# EAGLE design 1 (EAGLE 9.6.2)
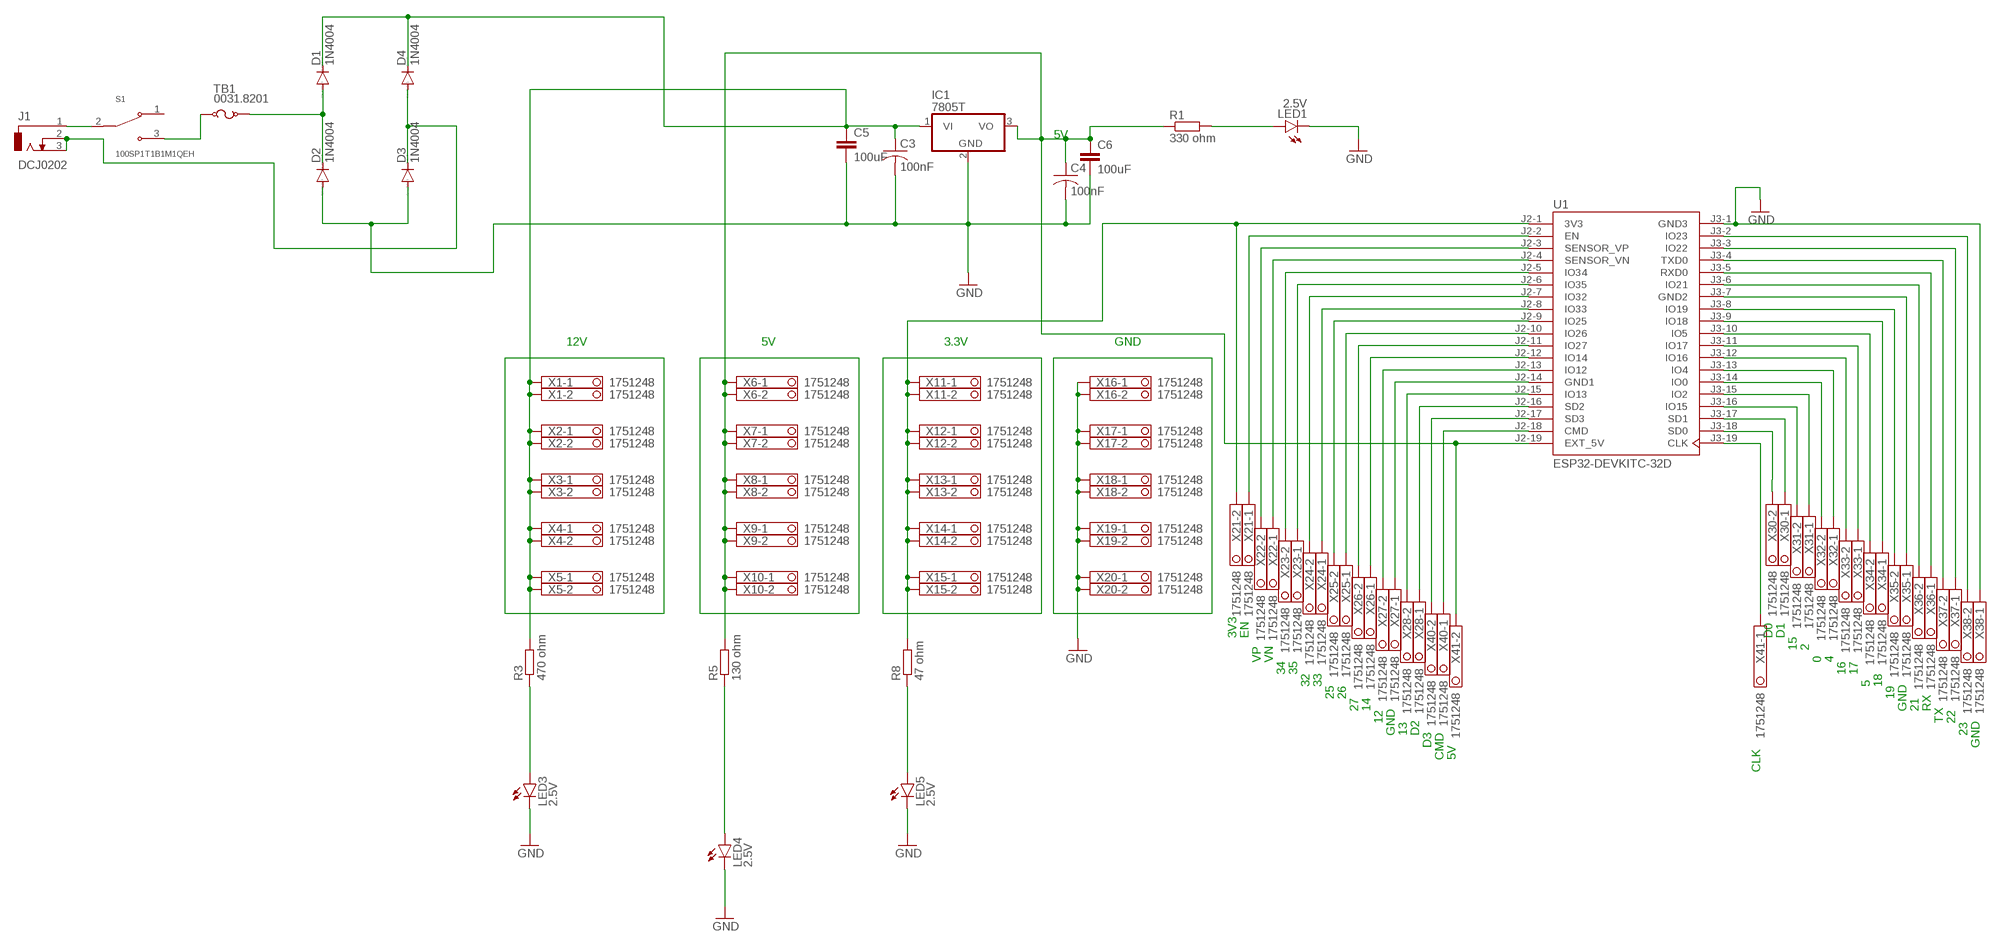
[diagram p0: schematic, sheet 1]

## Parts
C3  100nF  C-US025-024X044  [C025-024X044]
C4  100nF  C-US025-024X044  [C025-024X044]
C5  100uF  C-EU025-050X050  [C025-050X050]
C6  100uF  C-EU025-050X050  [C025-050X050]
D1  1N4004  [DO41-10]
D2  1N4004  [DO41-10]
D3  1N4004  [DO41-10]
D4  1N4004  [DO41-10]
IC1  7805T  [TO220H]
J1  DCJ0202  [DCJ0202]
LED1  2.5V  LED3MM  [LED3MM]
LED3  2.5V  LED3MM  [LED3MM]
LED4  2.5V  LED3MM  [LED3MM]
LED5  2.5V  LED3MM  [LED3MM]
R1  330 ohm  R-EU_0207/10  [0207/10]
R3  470 ohm  R-EU_0207/10  [0207/10]
R5  130 ohm  R-EU_0207/10  [0207/10]
R8  47 ohm  R-EU_0207/10  [0207/10]
S1  100SP1T1B1M1QEH  [SW_100SP1T1B1M1QEH]
TB1  0031.8201  [SCHURTER_0031.8201]
U1  ESP32-DEVKITC-32D  [MODULE_ESP32-DEVKITC-32D]
X1  1751248  [1751248]
X2  1751248  [1751248]
X3  1751248  [1751248]
X4  1751248  [1751248]
X5  1751248  [1751248]
X6  1751248  [1751248]
X7  1751248  [1751248]
X8  1751248  [1751248]
X9  1751248  [1751248]
X10  1751248  [1751248]
X11  1751248  [1751248]
X12  1751248  [1751248]
X13  1751248  [1751248]
X14  1751248  [1751248]
X15  1751248  [1751248]
X16  1751248  [1751248]
X17  1751248  [1751248]
X18  1751248  [1751248]
X19  1751248  [1751248]
X20  1751248  [1751248]
X21  1751248  [1751248]
X22  1751248  [1751248]
X23  1751248  [1751248]
X24  1751248  [1751248]
X25  1751248  [1751248]
X26  1751248  [1751248]
X27  1751248  [1751248]
X28  1751248  [1751248]
X30  1751248  [1751248]
X31  1751248  [1751248]
X32  1751248  [1751248]
X33  1751248  [1751248]
X34  1751248  [1751248]
X35  1751248  [1751248]
X36  1751248  [1751248]
X37  1751248  [1751248]
X38  1751248  [1751248]
X40  1751248  [1751248]
X41  1751248  [1751248]

## Nets
GND: C3.2 C4.2 C5.2 C6.2 D2.A D3.A IC1.2(GND) LED1.K(C) LED3.K(C) LED4.K(C) LED5.K(C) U1.J3-1(GND3) X16.1 X16.2 X17.1 X17.2 X18.1 X18.2 X19.1 X19.2 X20.1 X20.2 X38.1
N$5: D3.C D4.A J1.2 J1.3
N$6: C4.1 C6.1 IC1.3(VO) R1.1 R5.2 U1.J2-19(EXT_5V) X6.1 X6.2 X7.1 X7.2 X8.1 X8.2 X9.1 X9.2 X10.1 X10.2 X41.2
N$7: LED1.A R1.2
N$8: R8.2 U1.J2-1(3V3) X11.1 X11.2 X12.1 X12.2 X13.1 X13.2 X14.1 X14.2 X15.1 X15.2 X21.2
N$9: U1.J2-2(EN) X21.1
N$10: U1.J2-3(SENSOR_VP) X22.2
N$11: U1.J2-4(SENSOR_VN) X22.1
N$12: U1.J2-5(IO34) X23.2
N$13: U1.J2-6(IO35) X23.1
N$14: U1.J2-7(IO32) X24.2
N$15: U1.J2-8(IO33) X24.1
N$16: U1.J2-9(IO25) X25.2
N$17: U1.J2-10(IO26) X25.1
N$18: U1.J2-11(IO27) X26.2
N$19: U1.J2-12(IO14) X26.1
N$20: U1.J2-13(IO12) X27.2
N$21: U1.J2-14(GND1) X27.1
N$22: U1.J2-15(IO13) X28.2
N$23: U1.J2-16(SD2) X28.1
N$24: U1.J2-17(SD3) X40.2
N$25: U1.J2-18(CMD) X40.1
N$26: U1.J3-19(CLK) X41.1
N$27: U1.J3-18(SD0) X30.2
N$28: U1.J3-17(SD1) X30.1
N$29: U1.J3-16(IO15) X31.2
N$30: U1.J3-15(IO2) X31.1
N$31: U1.J3-14(IO0) X32.2
N$32: U1.J3-13(IO4) X32.1
N$33: U1.J3-12(IO16) X33.2
N$34: U1.J3-11(IO17) X33.1
N$35: U1.J3-10(IO5) X34.2
N$36: U1.J3-9(IO18) X34.1
N$37: U1.J3-8(IO19) X35.2
N$38: U1.J3-7(GND2) X35.1
N$39: U1.J3-6(IO21) X36.2
N$40: U1.J3-5(RXD0) X36.1
N$41: U1.J3-4(TXD0) X37.2
N$42: U1.J3-3(IO22) X37.1
N$43: U1.J3-2(IO23) X38.2
N$44: LED3.A R3.1
N$45: D1.A D2.C TB1.2
N$46: S1.3 TB1.1
N$47: C3.1 C5.1 D1.C D4.C IC1.1(VI) R3.2 X1.1 X1.2 X2.1 X2.2 X3.1 X3.2 X4.1 X4.2 X5.1 X5.2
N$50: J1.1 S1.2
N$53: LED4.A R5.1
N$54: LED5.A R8.1
Unconnected: S1.1

## Notes on the sheet
- 5V
- 12V | 5V | 3.3V | GND
- 3V3 | EN | D0 | D1
- 15 | 2
- VP | VN | 0 | 4
- 34 | 35 | 16 | 17
- 32 | 33 | 5 | 18
- 25 | 26 | 19
- 27 | 14 | GND | 21 | RX
- 12 | TX | 22
- GND | 13 | D2 | 23
- D3 | GND
- CMD | 5V
- CLK

## Library data of the parts
C3 C4 = rcl:C-US: CAPACITOR, American symbol; SPICEPREFIX: C
C5 C6 = rcl:C-EU: CAPACITOR, European symbol; SPICEPREFIX: C
D1-D4 = diode:1N4004: DIODE general purpose rectifier, 1 A
IC1 = linear:78*: Positive VOLTAGE REGULATOR Source: http://cache.national.com/ds/LM/LM78L05.pdf http://www.fairchildsemi.com/ds/LM/LM7805.pdf
J1 = con-jack:DCJ0202: DC POWER JACK Source: DCJ0202.pdf; OC_FARNELL: unknown; OC_NEWARK: unknown
LED1 LED3-LED5 = led:LED: LED OSRAM: - CHIPLED LG R971, LG N971, LY N971, LG Q971, LY Q971, LO R971, LY R971 LH N974, LH R974 LS Q976, LO Q976, LY Q976 LO Q996 - Hyper CHIPLED LW Q18S LB Q993, LB Q99A, LB R99A - SideLED LS A670, LO A670, LY A670, LG A670, LP A670 LB A673, LV A673, LT A673, LW A673 LH A674 LY A675 LS A676, LA A676, LO A676, LY A676, LW A676 LS A679, LY A679, LG A679 - Hyper Micro SIDELED® LS Y876, LA Y876, LO Y876, LY Y876 LT Y87S - SmartLED LW L88C, LW L88S LB L89C, LB L89S, LG L890 LS L89K, LO L89K, LY L89K LS L896, LA L896, LO L896, LY L896 - TOPLED LS T670, LO T670, LY T670, LG T670, LP T670 LSG T670, LSP T670, LSY T670, LOP T670, LYG T670 LG T671, LOG T671, LSG T671 LB T673, LV T673, LT T673, LW T673 LH T674 LS T676, LA T676, LO T676, LY T676, LB T676, LH T676, LSB T676, LW T676 LB T67C, LV T67C, LT T67C, LS T67K, LO T67K, LY T67K, LW E67C LS E67B, LA E67B, LO E67B, LY E67B, LB E67C, LV E67C, LT E67C LW T67C LS T679, LY T679, LG T679 LS T770, LO T770, LY T770, LG T770, LP T770 LB T773, LV T773, LT T773, LW T773 LH T774 LS E675, LA E675, LY E675, LS T675 LS T776, LA T776, LO T776, LY T776, LB T776 LHGB T686 LT T68C, LB T68C - Hyper Mini TOPLED® LB M676 - Mini TOPLED Santana® LG M470 LS M47K, LO M47K, LY M47K Source: http://www.osram.convergy.de LUXEON: - LUMILED® LXK2-PW12-R00, LXK2-PW12-S00, LXK2-PW14-U00, LXK2-PW14-V00 LXK2-PM12-R00, LXK2-PM12-S00, LXK2-PM14-U00 LXK2-PE12-Q00, LXK2-PE12-R00, LXK2-PE12-S00, LXK2-PE14-T00, LXK2-PE14-U00 LXK2-PB12-K00, LXK2-PB12-L00, LXK2-PB12-M00, LXK2-PB14-N00, LXK2-PB14-P00, LXK2-PB14-Q00 LXK2-PR12-L00, LXK2-PR12-M00, LXK2-PR14-Q00, LXK2-PR14-R00 LXK2-PD12-Q00, LXK2-PD12-R00, LXK2-PD12-S00 LXK2-PH12-R00, LXK2-PH12-S00 LXK2-PL12-P00, LXK2-PL12-Q00, LXK2-PL12-R00 Source: www.luxeon.com KINGBRIGHT: KA-3528ASYC Source: www.kingbright.com
R1 R3 R5 R8 = rcl:R-EU_: RESISTOR, European symbol; SPICEPREFIX: R
S1 = 100SP1T1B1M1QEH:100SP1T1B1M1QEH: Toggle Switch SPDT Panel Mount Check availability <https://pricing.snapeda.com/parts/100SP1T1B1M1QEH/E-Switch/view-part?ref=eda>; AVAILABILITY: In Stock; CHECK_PRICES: https://www.snapeda.com/parts/100SP1T1B1M1QEH/E-Switch/view-part/?ref=eda; DESCRIPTION: Toggle Switch, 100 Series, SPDT, ON-NONE-ON, Sealed, 5A, 120VAC, 28VDC, Solder | E-Switch 100SP1T1B1M1QEH; MF: E-Switch; MP: 100SP1T1B1M1QEH; PACKAGE: None; PRICE: None; PURCHASE-URL: https://www.snapeda.com/api/url_track_click_mouser/?unipart_id=423929&manufacturer=E-Switch&part_name=100SP1T1B1M1QEH&search_term=sw-t3-2b-a-a3-s1; SNAPEDA_LINK: https://www.snapeda.com/parts/100SP1T1B1M1QEH/E-Switch/view-part/?ref=snap
TB1 = 0031.8201:0031.8201: Fuse Block; 1-Pole; 500V; 10A; Solder THT; PCB Mnt, 22.5mm Pin Spacing; 5x20mm; UL94V-0 Check availability <https://pricing.snapeda.com/parts/0031.8201/Schurter%20Inc./view-part?ref=eda>; AVAILABILITY: In Stock; CHECK_PRICES: https://www.snapeda.com/parts/0031.8201/Schurter+Inc./view-part/?ref=eda; DESCRIPTION: Fuseholder, 250V, 10A, 22.5, 3 kV, @ 50 Hz, 1 Minute, Copper Alloy, OGN Series | Schurter 0031.8201; MF: Schurter Inc.; MP: 0031.8201; PACKAGE: None; PRICE: None; PURCHASE-URL: https://www.snapeda.com/api/url_track_click_mouser/?unipart_id=235177&manufacturer=Schurter Inc.&part_name=0031.8201&search_term=0031.8201; SNAPEDA_LINK: https://www.snapeda.com/parts/0031.8201/Schurter+Inc./view-part/?ref=snap
U1 = ESP32-DEVKITC-32D:ESP32-DEVKITC-32D: Check availability <https://pricing.snapeda.com/parts/ESP32-DEVKITC-32D/Espressif%20Systems/view-part?ref=eda>; AVAILABILITY: In Stock; CHECK_PRICES: https://www.snapeda.com/parts/ESP32-DEVKITC-32D/Espressif+Systems/view-part/?ref=eda; DESCRIPTION: WiFi Development Tools (802.11) ESP32 General Development Kit, ESP32-WROOM-32D on the board; MF: Espressif Systems; MP: ESP32-DEVKITC-32D; PACKAGE: None; PRICE: None; PURCHASE-URL: https://www.snapeda.com/api/url_track_click_mouser/?unipart_id=2777395&manufacturer=Espressif Systems&part_name=ESP32-DEVKITC-32D&search_term=None; SNAPEDA_LINK: https://www.snapeda.com/parts/ESP32-DEVKITC-32D/Espressif+Systems/view-part/?ref=snap
X1-X28 X30-X38 X40 X41 = con-phoenix-350:1751248: MKDS 1/ 2-3,5 Printklemme Nennstrom: 10 A Bemessungsspannung: 160 V Raster: 3,5 mm Polzahl: 2 Montageart: Löten Anschlussart: Schraubanschluss Anschlussrichtung vom Leiter zur Platine: 0° Source: http://eshop.phoenixcontact.com .. 1751248.pdf; OC_FARNELL: unknown; OC_NEWARK: unknown

## Board
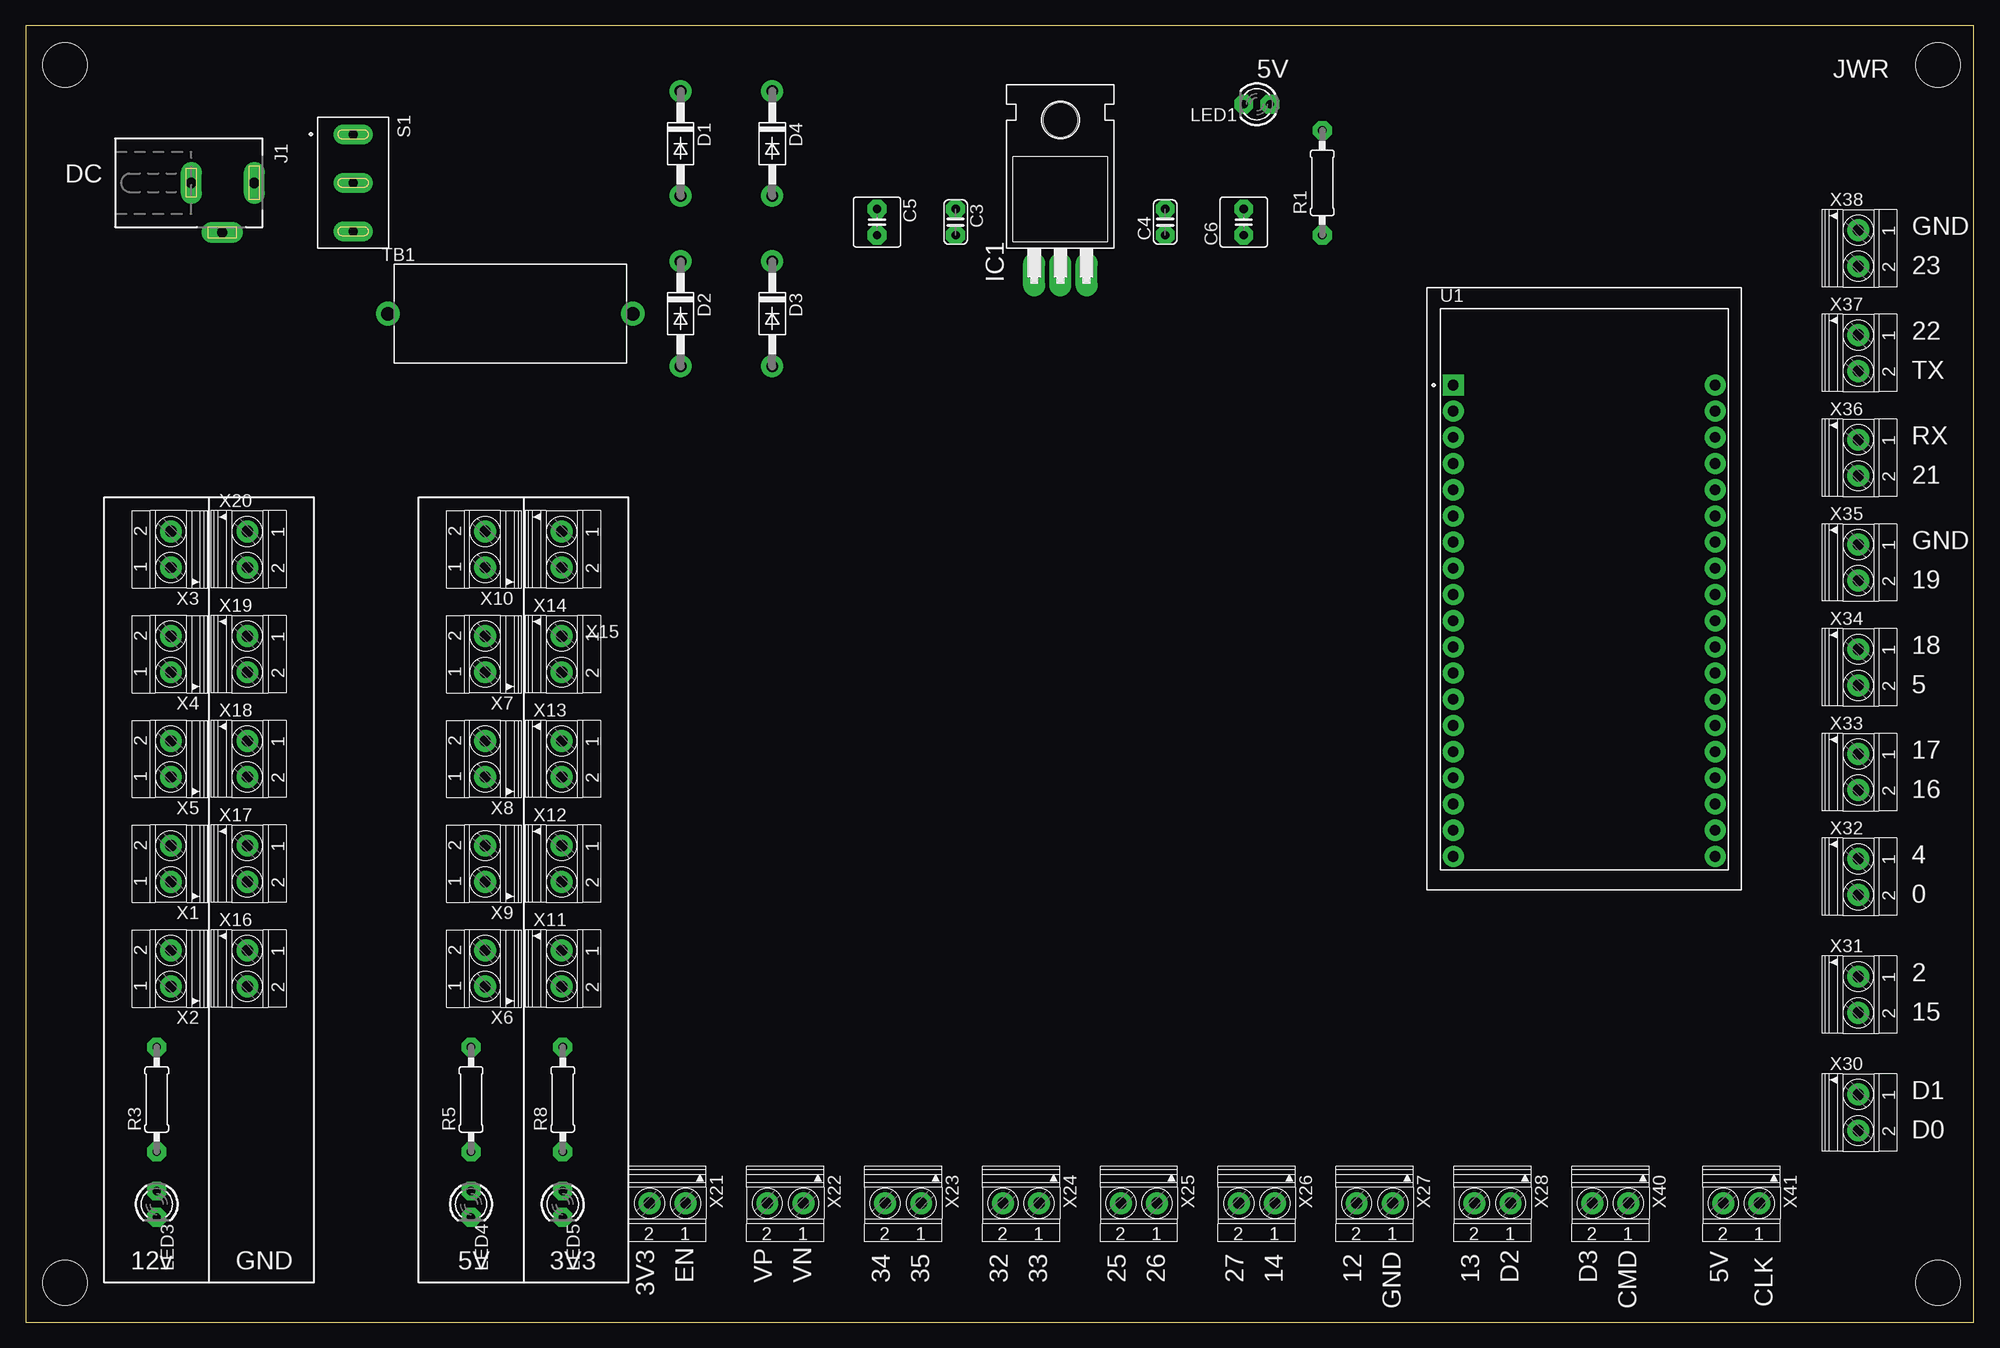
[diagram p1: board, top side]
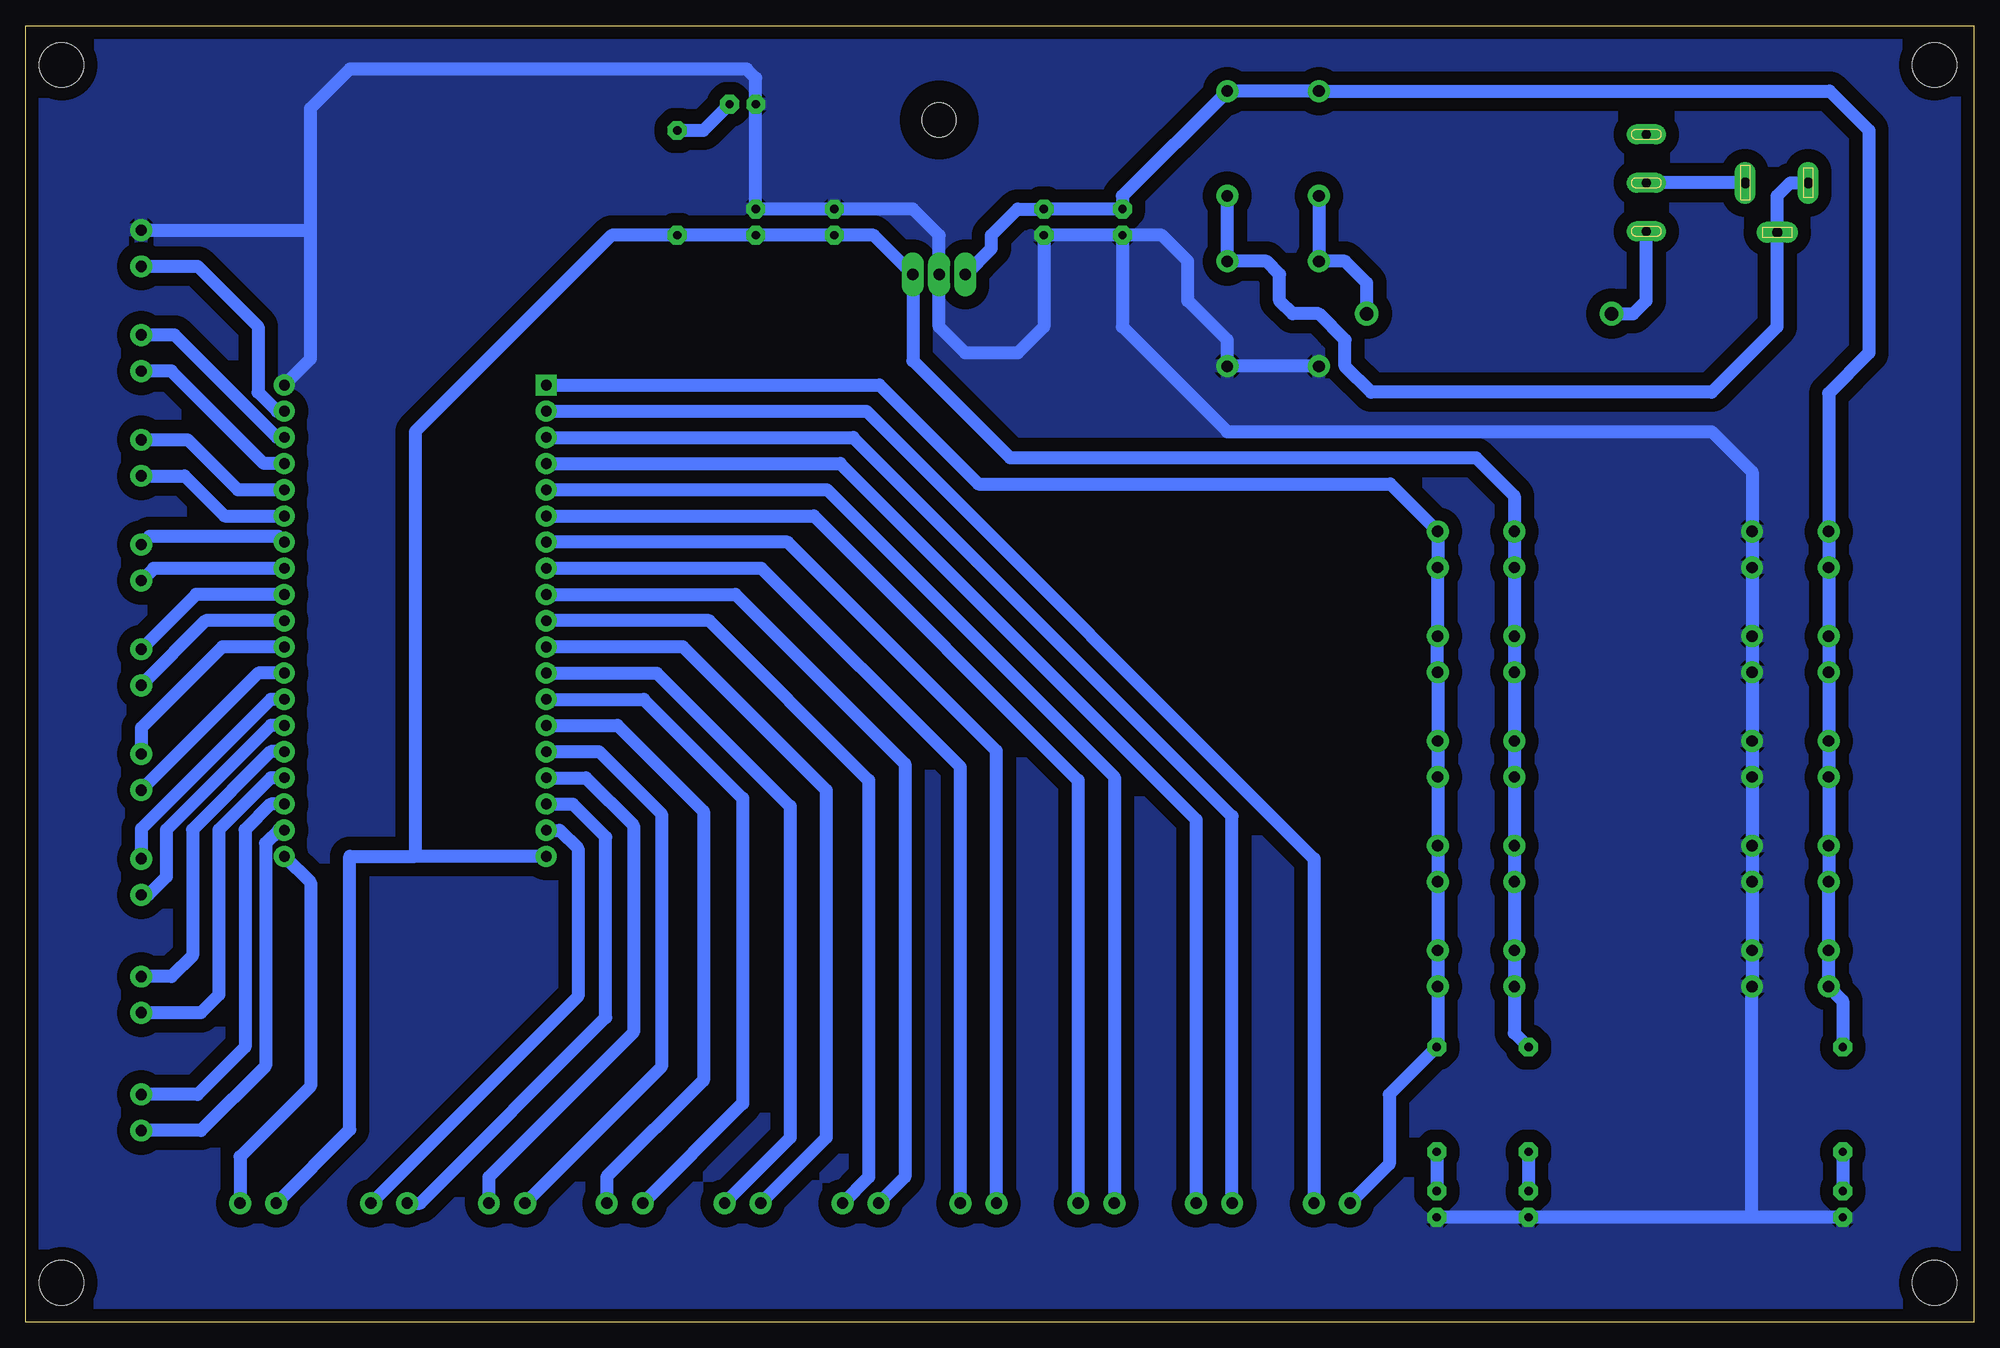
[diagram p2: board, bottom side, seen from below]

Size 188.9 x 125.72 mm. Coordinates in mm from the lower left corner, seen from the top.
Outline: 0,0 188.9,0 188.9,125.72 0,125.72 0,0
Copper layers (1*16): Top 0.035mm / dielectric 1.5mm / Bottom 0.035mm
Design rules "default *": minimum track width 50mil, minimum drill 0.35mm, track to track 6mil, track to pad 6mil, pad to pad 6mil, via to via 6mil, smd to smd 6mil, copper to edge 50mil, drill to drill 10mil, minimum pad ring 20mil, minimum via ring 8mil, stop-mask expansion 10mil, vias tented up to drill 0mil, thermal gap 10mil
Holes 4.32 mm at 3.81,121.92 3.81,3.81 185.42,3.81 185.42,121.92

### Footprints (pad centres in the part's own frame; a part is rotated, then mirrored left to right if it is on the bottom)
C025-024X044 = drill 0.813 octagon: 1 -1.27,0; 2 1.27,0
C025-050X050 = drill 0.813 octagon: 1 -1.27,0; 2 1.27,0
DO41-10 = drill 1.118: A 5.08,0; C -5.08,0
TO220H = drill 1.118 long: 1 -2.54,-10.16; 2 0,-10.16; 3 2.54,-10.16 | hole 3.302: 0,4.826
DCJ0202 = drill 1 pad 2 long: 1 0,3.1; 2 4.8,0; 3 0,-3
LED3MM = drill 0.813 octagon: A -1.27,0; K 1.27,0
0207/10 = drill 0.813 octagon: 1 -5.08,0; 2 5.08,0
SW_100SP1T1B1M1QEH = drill 0.91 pad 1.81 long: 1 -4.7,0; 2 0,0; 3 4.7,0
SCHURTER_0031.8201 = drill 1.3: 1 -11.875,0; 2 11.875,0
MODULE_ESP32-DEVKITC-32D = drill 1.04 square: J2-1 -12.7,19.76 | drill 1.04: J2-2 -12.7,17.22; J2-3 -12.7,14.68; J2-4 -12.7,12.14; J2-5 -12.7,9.6; J2-6 -12.7,7.06; J2-7 -12.7,4.52; J2-8 -12.7,1.98; J2-9 -12.7,-0.56; J2-10 -12.7,-3.1; J2-11 -12.7,-5.64; J2-12 -12.7,-8.18; J2-13 -12.7,-10.72; J2-14 -12.7,-13.26; J2-15 -12.7,-15.8; J2-16 -12.7,-18.34; J2-17 -12.7,-20.88; J2-18 -12.7,-23.42; J2-19 -12.7,-25.96; J3-1 12.7,19.76; J3-2 12.7,17.22; J3-3 12.7,14.68; J3-4 12.7,12.14; J3-5 12.7,9.6; J3-6 12.7,7.06; J3-7 12.7,4.52; J3-8 12.7,1.98; J3-9 12.7,-0.56; J3-10 12.7,-3.1; J3-11 12.7,-5.64; J3-12 12.7,-8.18; J3-13 12.7,-10.72; J3-14 12.7,-13.26; J3-15 12.7,-15.8; J3-16 12.7,-18.34; J3-17 12.7,-20.88; J3-18 12.7,-23.42; J3-19 12.7,-25.96
1751248 = drill 1.1 pad 1.7: 1 -1.75,-0.1; 2 1.75,-0.1

### Placement (x,y rotation side)
C3  90.17,106.68 270 top
C4  110.49,106.68 90 top
C5  82.55,106.68 270 top
C6  118.11,106.68 90 top
D1  63.5,114.3 270 top
D2  63.5,97.79 270 top
D3  72.39,97.79 270 top
D4  72.39,114.3 270 top
IC1  100.33,111.76 0 top
J1  19.05,110.49 270 top
LED1  119.38,118.11 180 top
LED3  12.7,11.43 270 top
LED4  43.18,11.43 270 top
LED5  52.07,11.43 270 top
R1  125.73,110.49 90 top
R3  12.7,21.59 90 top
R5  43.18,21.59 90 top
R8  52.07,21.59 90 top
S1  31.75,110.49 270 top
TB1  46.99,97.79 0 top
U1  151.13,71.12 0 top
X1  13.97,44.45 90 top
X2  13.97,34.29 90 top
X3  13.97,74.93 90 top
X4  13.97,64.77 90 top
X5  13.97,54.61 90 top
X6  44.45,34.29 90 top
X7  44.45,64.77 90 top
X8  44.45,54.61 90 top
X9  44.45,44.45 90 top
X10  44.45,74.93 90 top
X11  52.07,34.29 270 top
X12  52.07,44.45 270 top
X13  52.07,54.61 270 top
X14  52.07,64.77 270 top
X15  52.07,74.93 270 top
X16  21.59,34.29 270 top
X17  21.59,44.45 270 top
X18  21.59,54.61 270 top
X19  21.59,64.77 270 top
X20  21.59,74.93 270 top
X21  62.23,11.43 180 top
X22  73.66,11.43 180 top
X23  85.09,11.43 180 top
X24  96.52,11.43 180 top
X25  107.95,11.43 180 top
X26  119.38,11.43 180 top
X27  130.81,11.43 180 top
X28  142.24,11.43 180 top
X30  177.8,20.32 270 top
X31  177.8,31.75 270 top
X32  177.8,43.18 270 top
X33  177.8,53.34 270 top
X34  177.8,63.5 270 top
X35  177.8,73.66 270 top
X36  177.8,83.82 270 top
X37  177.8,93.98 270 top
X38  177.8,104.14 270 top
X40  153.67,11.43 180 top
X41  166.37,11.43 180 top

### Tracks (layer width: path | path; a pad name or v marks a point on that pad's centre or on a via)
GND
  Bottom 1.27: C5.2 82.55,96.52 72.39,86.36 25.4,86.36 21.49,82.45 X20.1 X20.2 X19.1 X19.2 X18.1 X18.2 X17.1 X17.2 X16.1 X16.2 21.59,32.44 21.59,10.16 | C5.2 C3.2 90.17,96.52 92.71,93.98 97.79,93.98 100.33,96.52 IC1.2 100.33,105.41 102.87,107.95 C4.2 C6.2 LED1.K 118.11,120.65 118.99,121.53 157.48,121.53 161.29,117.72 161.29,105.41 | LED3.K 21.59,10.16 | 21.59,10.16 LED4.K LED5.K | C5.2 78.74,105.41 76.2,102.87 76.2,99.06 72.39,95.25 D3.A D2.A | U1.J3-1 161.29,93.42 161.29,105.41 | X38.1 161.77,105.89 161.29,105.41
  pour Bottom (isolate 1.27): 6.35,138.43 -8.89,123.19 -8.89,1.27 6.35,-13.97 33.02,-13.97 193.04,-13.97 219.71,12.7 219.71,109.22 181.61,147.32 15.24,147.32
N$5
  Bottom 1.27: J1.3 17.78,110.49 19.05,109.22 J1.2 19.05,96.52 25.4,90.17 58.42,90.17 60.96,92.71 60.96,95.25 63.5,97.79 66.04,97.79 67.31,99.06 67.31,101.6 68.58,102.87 D3.C D4.A
N$6
  Bottom 1.27: R5.2 44.55,28.04 X6.1 X6.2 X9.1 X9.2 X8.1 X8.2 X7.1 X7.2 X10.1 X10.2 44.55,80.11 48.26,83.82 93.45,83.82 102.87,93.24 IC1.3 106.68,105.41 C4.1 C6.1 R1.1 132.08,105.41 151.13,86.36 151.13,45.16 | U1.J2-19 151.13,45.16 | 151.13,45.16 157.48,45.16 157.48,18.67 X41.2
N$7
  Bottom 1.27: R1.2 123.19,115.57 LED1.A
N$8
  Bottom 1.27: U1.J2-1 106.12,90.88 96.52,81.28 56.57,81.28 X15.1 X15.2 X14.1 52.07,66.42 52.07,63.02 X14.2 X13.1 X13.2 X12.1 X12.2 X11.1 X11.2 51.97,26.67 R8.2 56.67,22.07 56.67,15.34 X21.2
N$9
  Bottom 1.27: U1.J2-2 107.39,88.34 63.98,44.93 X21.1
N$10
  Bottom 1.27: X22.2 71.91,49.05 108.66,85.8 U1.J2-3
N$11
  Bottom 1.27: U1.J2-4 109.93,83.26 75.41,48.74 X22.1
N$12
  Bottom 1.27: U1.J2-5 111.2,80.72 83.34,52.86 X23.2
N$13
  Bottom 1.27: U1.J2-6 112.47,78.18 86.84,52.55 X23.1
N$14
  Bottom 1.27: U1.J2-7 115.01,75.64 94.77,55.4 X24.2
N$15
  Bottom 1.27: X24.1 98.27,53.82 117.55,73.1 U1.J2-8
N$16
  Bottom 1.27: U1.J2-9 120.09,70.56 103.66,54.13 103.66,14.07 X25.2
N$17
  Bottom 1.27: X25.1 107.16,14.07 107.16,52.55 122.63,68.02 U1.J2-10
N$18
  Bottom 1.27: X26.2 111.28,17.88 111.28,51.59 125.17,65.48 U1.J2-11
N$19
  Bottom 1.27: U1.J2-12 127.71,62.94 114.78,50.01 114.78,17.88 X26.1
N$20
  Bottom 1.27: U1.J2-13 128.98,60.4 119.38,50.8 119.38,21.21 X27.2
N$21
  Bottom 1.27: U1.J2-14 131.52,57.86 123.19,49.53 123.19,23.44 132.56,14.07 X27.1
N$22
  Bottom 1.27: X28.2 127.27,24.75 127.27,49.27 133.32,55.32 U1.J2-15
N$23
  Bottom 1.27: X28.1 143.99,14.07 129.96,28.1 129.96,48.15 134.59,52.78 U1.J2-16
N$24
  Bottom 1.27: X40.2 150.65,11.53 132.65,29.53 132.65,47.03 135.86,50.24 U1.J2-17
N$25
  Bottom 1.27: X40.1 135.34,31.61 135.34,45.91 137.13,47.7 U1.J2-18
N$26
  Bottom 1.27: U1.J3-19 161.29,42.62 161.29,22.86 168.12,16.03 X41.1
N$27
  Bottom 1.27: X30.2 171.93,18.57 165.64,24.86 165.64,46.45 164.39,47.7 U1.J3-18
N$28
  Bottom 1.27: X30.1 172.24,22.07 167.64,26.67 167.64,47.73 165.13,50.24 U1.J3-17
N$29
  Bottom 1.27: X31.2 171.93,30 170.18,31.75 170.18,47.73 165.13,52.78 U1.J3-16
N$30
  Bottom 1.27: X31.1 174.78,33.5 172.72,35.56 172.72,47.73 165.13,55.32 U1.J3-15
N$31
  Bottom 1.27: X32.2 177.01,41.43 175.26,43.18 175.26,47.73 165.13,57.86 U1.J3-14
N$32
  Bottom 1.27: X32.1 177.7,47.83 165.13,60.4 U1.J3-13
N$33
  Bottom 1.27: U1.J3-12 166.35,62.94 X33.2
N$34
  Bottom 1.27: U1.J3-11 169.85,65.48 177.7,57.63 X33.1
N$35
  Bottom 1.27: U1.J3-10 171.43,68.02 X34.2
N$36
  Bottom 1.27: U1.J3-9 172.39,70.56 X34.1
N$37
  Bottom 1.27: U1.J3-8 176.51,73.1 X35.2
N$38
  Bottom 1.27: U1.J3-7 164.39,76.2 176.91,76.2 X35.1
N$39
  Bottom 1.27: X36.2 173.51,82.07 169.62,78.18 U1.J3-6
N$40
  Bottom 1.27: X36.1 173.2,85.57 168.35,80.72 U1.J3-5
N$41
  Bottom 1.27: U1.J3-4 165.81,83.26 174.78,92.23 X37.2
N$42
  Bottom 1.27: U1.J3-3 164.54,85.8 174.47,95.73 X37.1
N$43
  Bottom 1.27: X38.2 172.24,102.39 166.37,96.52 166.37,90.17 164.54,88.34 U1.J3-2
N$44
  Bottom 1.27: R3.1 LED3.A
N$45
  Bottom 1.27: TB1.2 58.87,100.78 60.96,102.87 D2.C D1.A
N$46
  Bottom 1.27: TB1.1 33.02,97.79 31.75,99.06 S1.3
N$47
  Bottom 1.27: R3.2 12.7,31.17 X2.1 X2.2 X1.1 X1.2 X5.1 X5.2 X4.1 X4.2 X3.1 X3.2 14.07,90.07 10.16,93.98 10.16,115.57 13.97,119.38 D1.C D4.C 82.55,109.22 C5.1 C3.1 92.71,107.95 95.25,105.41 95.25,104.14 IC1.1
N$50
  Bottom 1.27: J1.1 S1.2
N$53
  Bottom 1.27: R5.1 LED4.A
N$54
  Bottom 1.27: R8.1 LED5.A

### Text on the board
tPlace: 5V | JWR | DC | GND | 23 | 22 | TX | RX | 21 | GND | 19 | 18 | 5 | 17 | 16 | 4 | 0 | 2 | 15 | D1 | D0 | CLK | 12v | GND | 5V | 3V3 | EN | VP | VN | 34 | 35 | 32 | 33 | 25 | 26 | 27 | 14 | 12 | 13 | D2 | D3 | 5V | 3V3 | GND | CMD